# Altium schematic sheet Placa_Alimentación.SchDoc
size A3
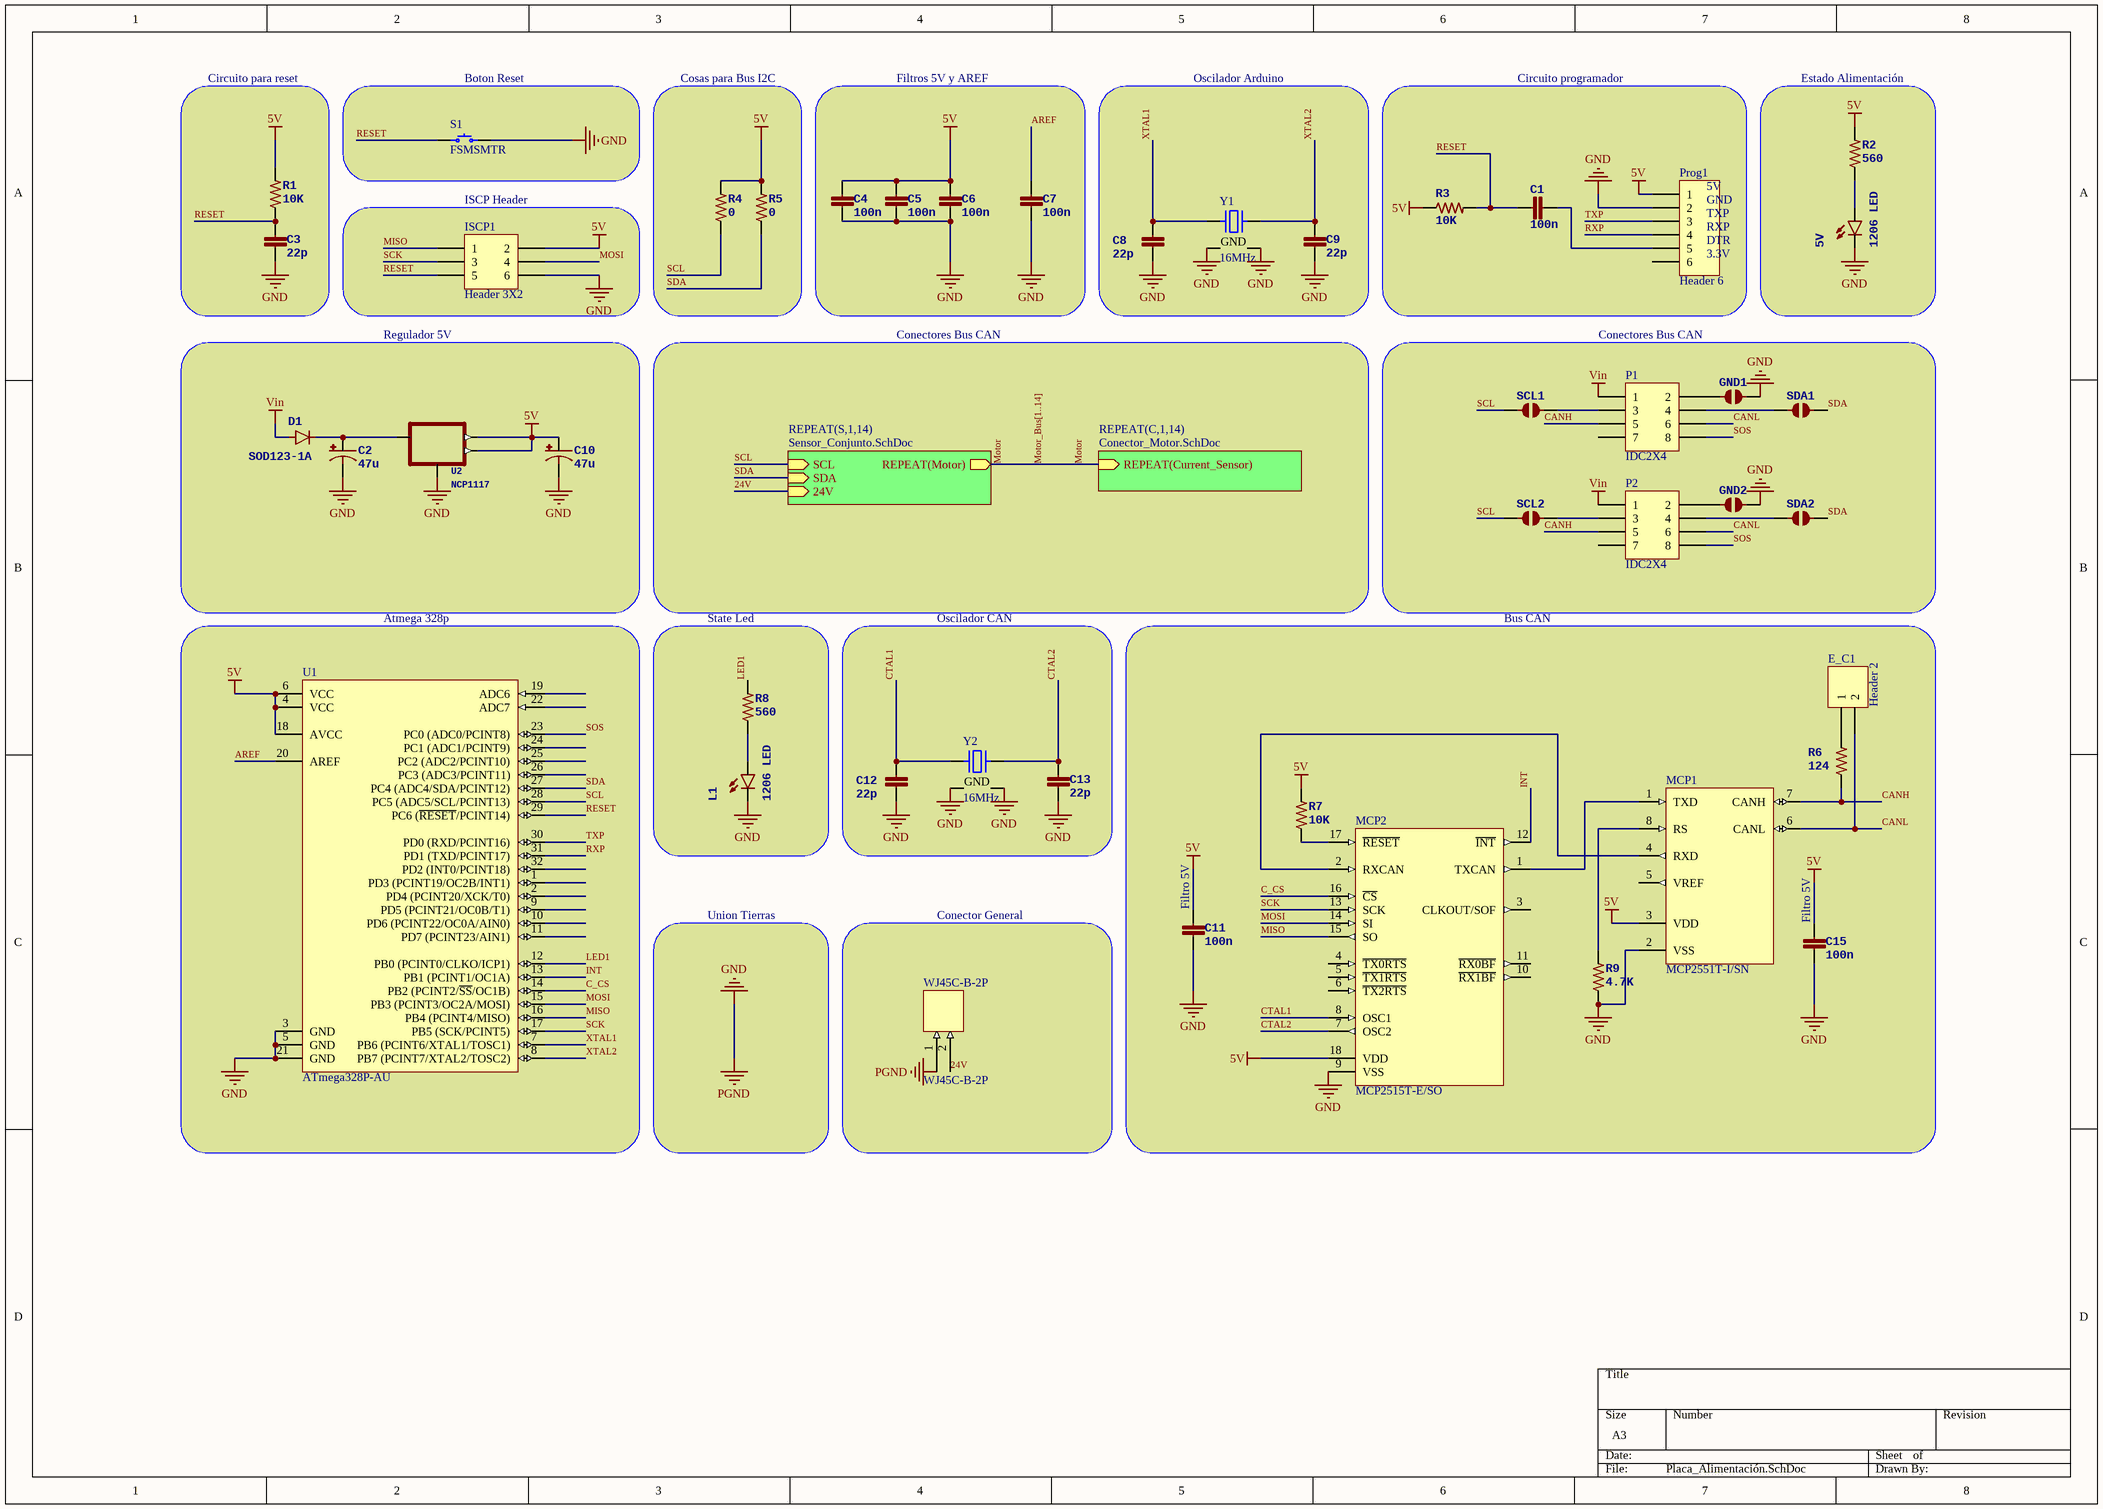
[diagram p0: Placa_Alimentación.SchDoc]

## Parts
5V  1206 LED  [LED-1206]
C1  100n  [0805]
C2  47u  [PANASONIC_D]
C3  22p  [0805]
C4  100n  [0805]
C5  100n  [0805]
C6  100n  [0805]
C7  100n  [0805]
C8  22p  [0805]
C9  22p  [0805]
C10  47u  [PANASONIC_D]
C11  100n  [0805]
C12  22p  [0805]
C13  22p  [0805]
C15  100n  [0805]
D1  SOD123-1A  [SOD-123]
E_C1  Header 2  [HDR1X2]
GND1  JUMPER-PAD-2-NOYES_SILK  [PAD-JUMPER-2-NO_YES_SILK]  (value not drawn)
GND2  JUMPER-PAD-2-NOYES_SILK  [PAD-JUMPER-2-NO_YES_SILK]  (value not drawn)
ISCP1  Header 3X2  [HDR2X3]
L1  1206 LED  [LED-1206]
MCP1  MCP2551T-I/SN  [SOIC-SN8_N]
MCP2  MCP2515T-E/SO  [SOIC-SO18_N]
P1  IDC2X4  [IDC2X4]
P2  IDC2X4  [IDC2X4]
Prog1  Header 6  [HDR1X6]
R1  10K  [0805]
R2  560  [0805]
R3  10K  [0805]
R4  0  [0805]
R5  0  [0805]
R6  124  [0805]
R7  10K  [0805]
R8  560  [0805]
R9  4.7K  [0805]
S1  FSMSMTR  [TE FSMSMTR]
SCL1  JUMPER-PAD-2-NOYES_SILK  [PAD-JUMPER-2-NO_YES_SILK]  (value not drawn)
SCL2  JUMPER-PAD-2-NOYES_SILK  [PAD-JUMPER-2-NO_YES_SILK]  (value not drawn)
SDA1  JUMPER-PAD-2-NOYES_SILK  [PAD-JUMPER-2-NO_YES_SILK]  (value not drawn)
SDA2  JUMPER-PAD-2-NOYES_SILK  [PAD-JUMPER-2-NO_YES_SILK]  (value not drawn)
U1  ATmega328P-AU  [32A_N]
U2  NCP1117  [SOT223]
WJ45C-B-2P  WJ45C-B-2P  [WJ45C-B-2P]
Y1  16MHz  [NDK NX3225SA]
Y2  16MHz  [NDK NX3225SA]

## Blocks framed on the sheet
Circuito para reset: C3 R1
Boton Reset: S1
Cosas para Bus I2C: R4 R5
Filtros 5V y AREF: C4-C7
Oscilador Arduino: C8 C9 Y1
Estado Alimentación: 5V R2
ISCP Header: ISCP1
Regulador 5V: C2 C10 D1 U2
Conectores Bus CAN: GND1 GND2 P1 P2 SCL1 SCL2 SDA1 SDA2
Atmega 328p: U1
State Led: L1 R8
Oscilador CAN: C12 C13 Y2
Conector General: WJ45C-B-2P

## Sub-sheets
REPEAT(C,1,14) = Conector_Motor.SchDoc: REPEAT(Current_Sensor) (in)
REPEAT(S,1,14) = Sensor_Conjunto.SchDoc: REPEAT(Motor) (out), SCL (in), SDA (in), 24V (in)

## Nets
5V: C4.1 C5.1 C6.1 C10.+ C11.1 C15.1 ISCP1.2 MCP1.3(VDD) MCP2.18(VDD) Prog1.1 R1.2 R2.2 R3.1 R4.2 R5.2 R7.2 U1.4(VCC) U1.6(VCC) U1.18(AVCC) U2.2(OUT) U2.4(OUT@1)
GND: 5V.C C2.- C3.2 C4.2 C5.2 C6.2 C7.2 C8.2 C9.2 C10.- C11.2 C12.2 C13.2 C15.2 GND1.2 GND2.2 ISCP1.6 L1.C MCP1.2(VSS) MCP2.9(VSS) Prog1.2 R9.1 S1.2 U1.3(GND) U1.5(GND) U1.21(GND) U2.1(ADJ) WJ45C-B-2P.1 Y1.2(GND) Y1.4(GND) Y2.2(GND) Y2.4(GND)  [also labelled PGND]
Vin: D1.A P1.1 P2.1
24V: WJ45C-B-2P.2 ; sheet REPEAT(S,1,14)/24V
AREF: C7.1 U1.20(AREF)
C_CS: MCP2.16(~{CS}) U1.14(PB2_(PCINT2/~{SS}/OC1B))
CANH: MCP1.7(CANH) P1.5 P2.5 R6.1
CANL: E_C1.2 MCP1.6(CANL) P1.6 P2.6
CTAL1: C12.1 MCP2.8(OSC1) Y2.1
CTAL2: C13.1 MCP2.7(OSC2) Y2.3
INT: MCP2.12(~{INT}) U1.13(PB1_(PCINT1/OC1A))
LED1: R8.2 U1.12(PB0_(PCINT0/CLKO/ICP1))
MISO: ISCP1.1 MCP2.15(SO) U1.16(PB4_(PCINT4/MISO))
MOSI: ISCP1.4 MCP2.14(SI) U1.15(PB3_(PCINT3/OC2A/MOSI))
Motor: sheet REPEAT(C,1,14)/REPEAT(Current_Sensor), sheet REPEAT(S,1,14)/REPEAT(Motor)
RESET: C1.1 C3.1 ISCP1.5 R1.1 R3.2 S1.1 U1.29(PC6_(~{RESET}/PCINT14))
RXP: Prog1.4 U1.31(PD1_(TXD/PCINT17))
SCK: ISCP1.3 MCP2.13(SCK) U1.17(PB5_(SCK/PCINT5))
SCL: R4.1 SCL1.1 SCL2.1 U1.28(PC5_(ADC5/SCL/PCINT13)) ; sheet REPEAT(S,1,14)/SCL
SDA: R5.1 SDA1.2 SDA2.2 U1.27(PC4_(ADC4/SDA/PCINT12)) ; sheet REPEAT(S,1,14)/SDA
SOS: P1.8 P2.8 U1.23(PC0_(ADC0/PCINT8))
TXP: Prog1.3 U1.30(PD0_(RXD/PCINT16))
XTAL1: C8.1 U1.7(PB6_(PCINT6/XTAL1/TOSC1)) Y1.1
XTAL2: C9.1 U1.8(PB7_(PCINT7/XTAL2/TOSC2)) Y1.3
Net5V_A: 5V.A R2.1
NetC1_2: C1.2 Prog1.5
NetC2_+: C2.+ D1.C U2.3(IN)
NetE_C1_1: E_C1.1 R6.2
NetGND1_1: GND1.1 P1.2
NetGND2_1: GND2.1 P2.2
NetL1_A: L1.A R8.1
NetMCP1_1: MCP1.1(TXD) MCP2.1(TXCAN)
NetMCP1_4: MCP1.4(RXD) MCP2.2(RXCAN)
NetMCP1_8: MCP1.8(RS) R9.2
NetMCP2_17: MCP2.17(~{RESET}) R7.1
NetP1_3: P1.3 SCL1.2
NetP1_4: P1.4 SDA1.1
NetP2_3: P2.3 SCL2.2
NetP2_4: P2.4 SDA2.1

Not connected (* = marked no-connect by the designer): MCP1 5(VREF); MCP2 3(CLKOUT/SOF) 4(~{TX0RTS}) 5(~{TX1RTS}) 6(~{TX2RTS}) 10(~{RX1BF}) 11(~{RX0BF}); P1 7; P2 7; Prog1 6; U1 1(PD3_(PCINT19/OC2B/INT1)) 2(PD4_(PCINT20/XCK/T0)) 9(PD5_(PCINT21/OC0B/T1)) 10(PD6_(PCINT22/OC0A/AIN0)) 11(PD7_(PCINT23/AIN1)) 19(ADC6) 22(ADC7) 24(PC1_(ADC1/PCINT9)) 25(PC2_(ADC2/PCINT10)) 26(PC3_(ADC3/PCINT11)) 32(PD2_(INT0/PCINT18))

## Buses and harness runs
bus Motor_Bus[1..14]

## Notes on the sheet
- Circuito programador
- (near Prog1) 5V
- (near Prog1) GND
- (near Prog1) TXP
- (near Prog1) RXP
- (near Prog1) DTR
- (near Prog1) 3.3V
- Conectores Bus CAN
- Bus CAN
- Union Tierras
- (near C11) Filtro 5V
- (near C15) Filtro 5V

## Library data of the parts
5V L1 = LED1206
C1 C3-C9 C11-C13 C15 = CAP0805
C2 C10 = 47UF-50V-20%(ELECT): PROD_ID: CAP-10547
D1 = DIODESOD123
E_C1 = Header 2: Header, 2-Pin; LatestRevisionDate: 17-Jul-2002; LatestRevisionNote: Re-released for DXP Platform.; Publisher: Altium Limited
ISCP1 = Header 3X2: Header, 3-Pin, Dual row; LatestRevisionDate: 17-Jul-2002; LatestRevisionNote: Re-released for DXP Platform.; Publisher: Altium Limited
MCP1 = MCP2551T-I/SN: High-Speed CAN Transceiver, 8-Pin SOIC, Industrial Temperature, Tape and Reel; Published: 29-Jan-2009; DatasheetVersion: revE, Jan-2007; PackageVersion: revBB, Aug-2009; PackageReference: SOIC-SN8; Publisher: Altium Limited; PackageDescription: 8-Lead Plastic Small Outline (SN) - Narrow, 3.90mm Body [SOIC]; Supplier 1: Digi-Key; Supplier Part Number 1: MCP2551T-I/SNTR-ND; Supplier 2: Farnell; Supplier Part Number 2: 1788569; Code_JEDEC: MS-012; Code_IPC: SOIC127P600-8; ComponentLink1Description: Datasheet; ComponentLink1URL: http://ww1.microchip.com/downloads/en/DeviceDoc/21667E.pdf; ComponentLink2Description: Packaging Specification; ComponentLink2URL: http://www.microchip.com/stellent/groups/techpub_sg/documents/packagingspec/en012702.pdf; ComponentLink3Description: Microchip.com Home; ComponentLink3URL: http://www.microchip.com/
MCP2 = MCP2515T-E/SO: Stand-Alone CAN Controller With SPI Interface, 18-Pin SOIC, Extended Temperature, Tape and Reel; Published: 29-Jan-2009; DatasheetVersion: revE, Nov-2007; PackageVersion: revBB, Aug-2009; PackageReference: SOIC-SO18; Publisher: Altium Limited; PackageDescription: 18-Lead Plastic Small Outline (SO) - Wide 7.50mm Body [SOIC]; Supplier 1: Digi-Key; Supplier Part Number 1: MCP2515T-E/SO-ND; Code_JEDEC: MS-013; ComponentLink1Description: Datasheet; ComponentLink1URL: http://ww1.microchip.com/downloads/en/DeviceDoc/21801e.pdf; ComponentLink2Description: Packaging Specification; ComponentLink2URL: http://www.microchip.com/stellent/groups/techpub_sg/documents/packagingspec/en012702.pdf; ComponentLink3Description: Microchip.com Home; ComponentLink3URL: http://www.microchip.com/
P1 P2 = IDC2X4: Header, 4-Pin, Dual row; LatestRevisionDate: 17-Jul-2002; LatestRevisionNote: Re-released for DXP Platform.; Publisher: Altium Limited
Prog1 = Header 6: Header, 6-Pin; LatestRevisionDate: 17-Jul-2002; LatestRevisionNote: Re-released for DXP Platform.; Publisher: Altium Limited
R1-R9 = RESISTOR0805-RES
S1 = FSMSMTR: SWITCH TACTILE SPST-NO 0.05A 24V; Manufacturer: TE Connectivity Alcoswitch Switches; Switch Function: Off-Mom; Contact Rating @ Voltage: 0.05A @ 24VDC; Actuator Type: Standard; Actuator Orientation: Top Actuated; Illumination: Non-Illuminated; Operating Force: 180gf; Switch Travel: 0.25mm; Mechanical Life: 20,000 Cycles; Part Number: FSMSMTR; PartId: 8251; Supplier 1: Digi-Key; Supplier Part Number 1: 450-1758-2-ND; ComponentLink1Description: Datasheet; ComponentLink1URL: http://www.te.com/commerce/DocumentDelivery/DDEController?Action=srchrtrv&DocNm=1437566-3&DocType=Customer+Drawing&DocLang=English; ComponentLink2Description: Digi-Key Listing; ComponentLink2URL: http://www.digikey.com/product-detail/en/FSMSMTR/450-1758-2-ND/529671; Price: 0,175; Circuit: SPST-NO; Illumination Voltage: -; Illumination Type, Colour: -; Operating Temperature: -35C ~ 85C
U1 = ATmega328P-AU: 8-bit AVR Microcontroller, 32KB Flash, 1KB EEPROM, 2KB SRAM, 32-pin TQFP, Industrial Grade (-40°C to 85°C); Published: 1-Apr-2010; DatasheetVersion: revA, Jan-2010; PackageVersion: revB, Oct-2001; PackageReference: 32A; Publisher: Altium Limited; PackageDescription: 32-Lead, 7x7x1.0 mm Body, 0.8mm Lead Pitch, Thin Profile Plastic Quad Flat Package (TQFP); Supplier 1: Digi-Key; Supplier Part Number 1: ATMEGA328P-AU-ND; Supplier 2: Farnell; Supplier Part Number 2: 1715486; Supplier 3: Mouser; Supplier Part Number 3: 556-ATMEGA328P-AU; Code_JEDEC: MS-026-ABA; ComponentLink1Description: Manufacturer Link; ComponentLink1URL: http://www.atmel.com/products/avr/default.asp?; ComponentLink2Description: ATmega48A/48PA/88A/88PA/168A/168PA/328/328P Datasheet; ComponentLink2URL: http://www.atmel.com/dyn/resources/prod_documents/8271.pdf; ComponentLink3Description: ATmega48A/48PA/88A/88PA/168A/168PA/328/328P Summary; ComponentLink3URL: http://www.atmel.com/dyn/resources/prod_documents/8271S.pdf; ComponentLink4Description: Atmel.com Home; ComponentLink4URL: http://www.atmel.com
U2 = V_REG_LM1117SOT223: PROD_ID: VREG-08170
Y1 Y2 = NX3225SA-16.000MHZ-STD-CSR-1: CRYSTAL 16.0000MHZ 8PF SMD; Manufacturer: NDK; Frequency Stability: 15ppm; ESR: 80 Ohm; Operating Mode: Fundamental; Part Number: NX3225SA-16.000MHZ-STD-CSR-1; PartId: 8509; Supplier 1: Digi-Key; Supplier Part Number 1: 644-1049-2-ND; ComponentLink1Description: Datasheet; ComponentLink1URL: http://media.digikey.com/pdf/Data%20Sheets/NDK%20PDFs/NX3225SA.pdf; ComponentLink2Description: Digi-Key Listing; ComponentLink2URL: http://www.digikey.com/product-detail/en/NX3225SA-16.000MHZ-STD-CSR-1/644-1049-2-ND/1128831; Price: 0,3799; Type: MHz Crystal; Device Package: 4-SMD, No Lead (DFN, LCC); Frequency: 16MHz; Frequency Tolerance: 15ppm; Load Capacitance: 8pF